# EasyEDA schematic Schematic.json
TITLE: Test Schematic - Stepper Driver + Tiny2040; REV: 2.0; Date: 2022-11-02; Sheet: 1/1; Drawn By: Der gang; Company: Wesel x Duisburg GANG
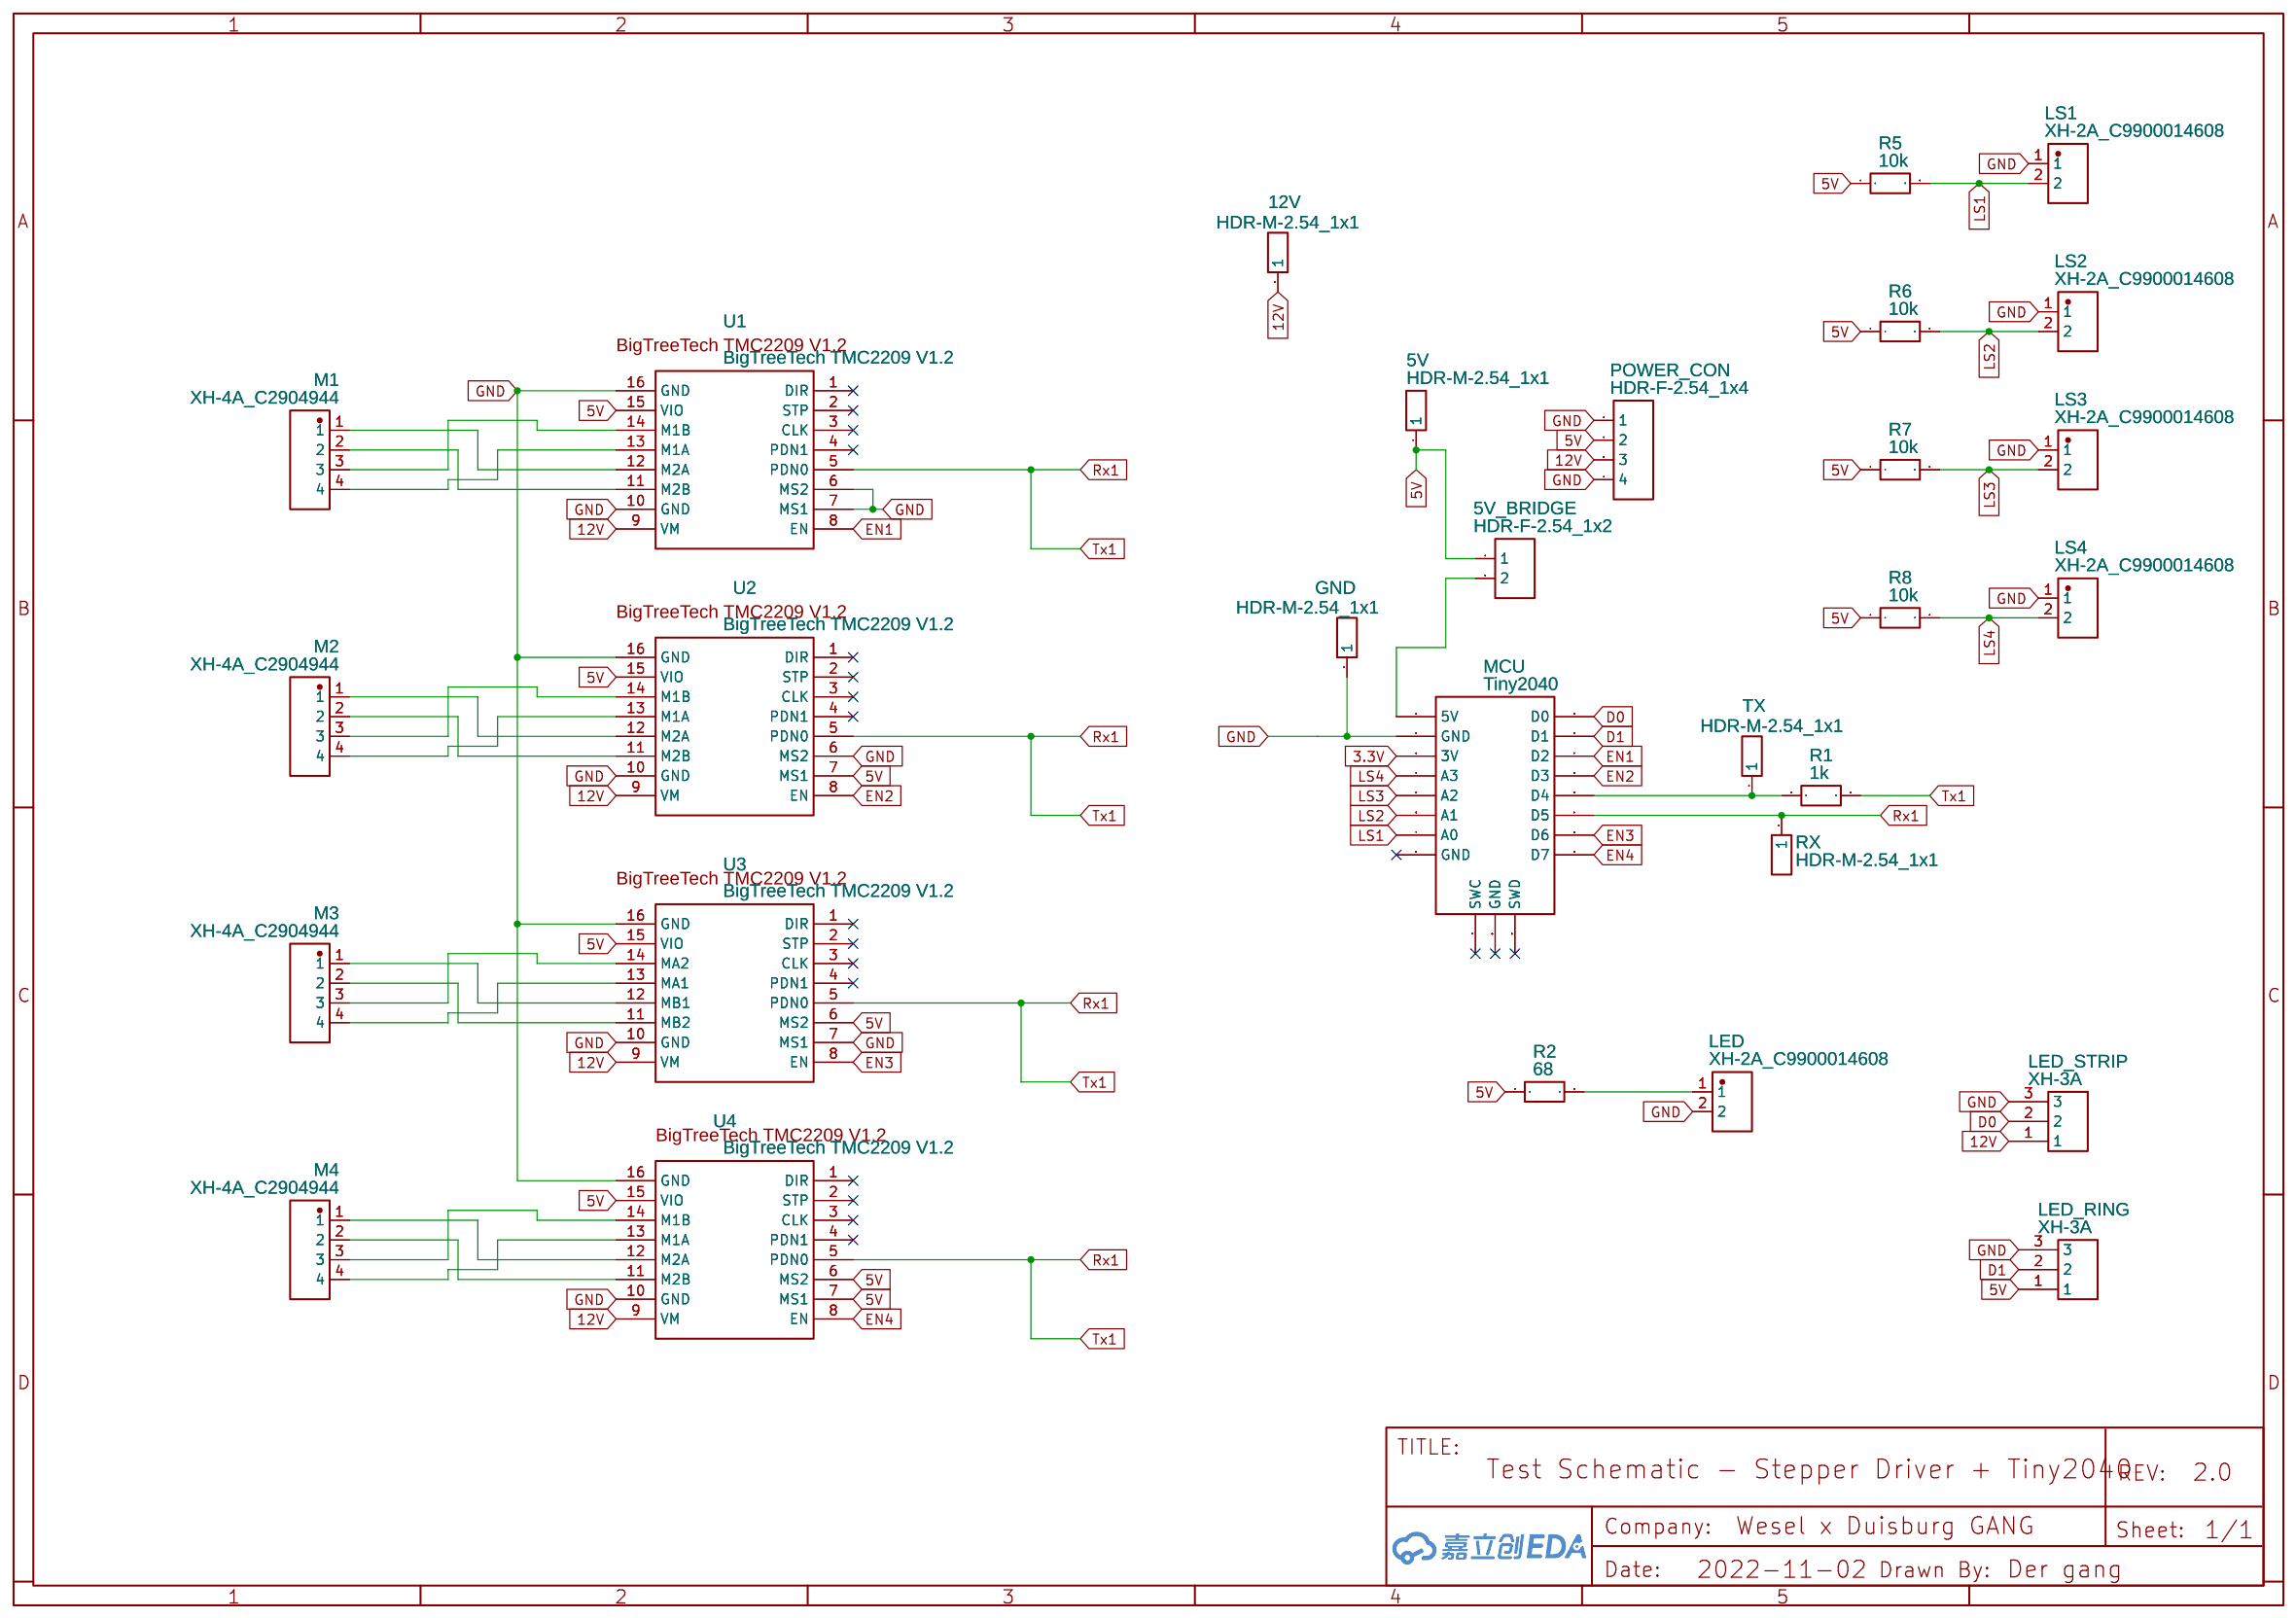
[diagram p0: schematic sheet]

## Parts
5V  HDR-M-2.54_1x1  [HDR-M-2.54_1X1]
5V_BRIDGE  HDR-F-2.54_1x2  [HDR-F-2.54_1X2]
12V  HDR-M-2.54_1x1  [HDR-M-2.54_1X1]
GND  HDR-M-2.54_1x1  [HDR-M-2.54_1X1]
LED  XH-2A_C9900014608  [CONN-TH_XH-2A]
LED_RING  XH-3A  [CONN-TH_XH-3A]
LED_STRIP  XH-3A  [CONN-TH_XH-3A]
LS1  XH-2A_C9900014608  [CONN-TH_XH-2A]
LS2  XH-2A_C9900014608  [CONN-TH_XH-2A]
LS3  XH-2A_C9900014608  [CONN-TH_XH-2A]
LS4  XH-2A_C9900014608  [CONN-TH_XH-2A]
M1  XH-4A_C2904944  [CONN-TH_4P-P2.50-XH2.54-4P]
M2  XH-4A_C2904944  [CONN-TH_4P-P2.50-XH2.54-4P]
M3  XH-4A_C2904944  [CONN-TH_4P-P2.50-XH2.54-4P]
M4  XH-4A_C2904944  [CONN-TH_4P-P2.50-XH2.54-4P]
MCU  Tiny2040  [TINY2040]
POWER_CON  HDR-F-2.54_1x4  [HDR-F-2.54_1X4]
R1  1k  [R0603]
R2  68  [R_AXIAL-0.3]
R5  10k  [R0603]
R6  10k  [R0603]
R7  10k  [R0603]
R8  10k  [R0603]
RX  HDR-M-2.54_1x1  [HDR-M-2.54_1X1]
TX  HDR-M-2.54_1x1  [HDR-M-2.54_1X1]
U1  BigTreeTech TMC2209 V1.2  [BIGTREETECH TMC2209 V1.2]
U2  BigTreeTech TMC2209 V1.2  [BIGTREETECH TMC2209 V1.2]
U3  BigTreeTech TMC2209 V1.2  [BIGTREETECH TMC2209 V1.2]
U4  BigTreeTech TMC2209 V1.2  [BIGTREETECH TMC2209 V1.2]

## Library data of the parts
5V 12V GND RX TX = HDR-M-2.54_1x1: Supplier Part: C81276; Supplier: LCSC; Contributor: LCEDA_Lib
5V_BRIDGE = HDR-F-2.54_1x2: Supplier Part: C49661; Supplier: LCSC; Contributor: LCEDA_Lib
LED LS1-LS4 = XH-2A_C9900014608: Supplier: LCSC; Supplier Part: C9900014608; Manufacturer: null; Manufacturer Part: XH-2A; JLCPCB Part Class: Extended Part; Contributor: lcsc
LED_RING LED_STRIP = XH-3A: Supplier: LCSC; Manufacturer: BOOMELE(博穆精密); Supplier Part: C2316; JLCPCB Part Class: Extended Part
M1-M4 = XH-4A_C2904944: Supplier: LCSC; Supplier Part: C2904944; Manufacturer: DEALON(德艺隆); Manufacturer Part: XH-4A; JLCPCB Part Class: Extended Part; Contributor: LCSC
MCU = Tiny2040: Manufacturer: Pimoroni; link: https://shop.pimoroni.com/products/tiny-2040; Contributor: Alexandre Hernandez Froio
POWER_CON = HDR-F-2.54_1x4: Supplier Part: C225501; Supplier: LCSC; Contributor: LCEDA_Lib
R1 R5-R8 = R_0603_EU: Contributor: LCEDA_Lib
R2 = R_AXIAL-0.3_EU: Contributor: LCEDA_Lib
U1-U4 = BigTreeTech TMC2209 V1.2: Manufacturer: BigTreeTech; Supplier: BigTreeTech; link: https://www.bigtree-tech.com/products/bigtreetech-tmc2209-v1-2-uart-stepper-motor-driver.html; Contributor: nikolay.malygin

## Nets
3.3V: MCU.3(3V)
5V: 5V.1 5V_BRIDGE.1 LED_RING.1 POWER_CON.2 R2.1 R5.1 R6.1 R7.1 R8.1 U1.15(VIO) U2.7(MS1) U2.15(VIO) U3.6(MS2) U3.15(VIO) U4.6(MS2) U4.7(MS1) U4.15(VIO)
12V: 12V.1 LED_STRIP.1 POWER_CON.3 U1.9(VM) U2.9(VM) U3.9(VM) U4.9(VM)
GND: GND.1 LED.2 LED_RING.3 LED_STRIP.3 LS1.1 LS2.1 LS3.1 LS4.1 MCU.2(GND) POWER_CON.1 POWER_CON.4 U1.6(MS2) U1.7(MS1) U1.10(GND) U1.16(GND) U2.6(MS2) U2.10(GND) U2.16(GND) U3.7(MS1) U3.10(GND) U3.16(GND) U4.10(GND) U4.16(GND)
D0: LED_STRIP.2 MCU.19(D0)
D1: LED_RING.2 MCU.18(D1)
EN1: MCU.17(D2) U1.8(EN)
EN2: MCU.16(D3) U2.8(EN)
EN3: MCU.13(D6) U3.8(EN)
EN4: MCU.12(D7) U4.8(EN)
LS1: LS1.2 MCU.7(A0) R5.2
LS2: LS2.2 MCU.6(A1) R6.2
LS3: LS3.2 MCU.5(A2) R7.2
LS4: LS4.2 MCU.4(A3) R8.2
Rx1: MCU.14(D5) R1.1 RX.1 U1.5(PDN0) U2.5(PDN0) U3.5(PDN0) U4.5(PDN0)
Net-(5V_BRIDGE-2): 5V_BRIDGE.2 MCU.1(5V)
Net-(LED-1): LED.1 R2.2
Net-(M1-1): M1.1 U1.12(M2A)
Net-(M1-2): M1.2 U1.11(M2B)
Net-(M1-3): M1.3 U1.14(M1B)
Net-(M1-4): M1.4 U1.13(M1A)
Net-(M2-1): M2.1 U2.12(M2A)
Net-(M2-2): M2.2 U2.11(M2B)
Net-(M2-3): M2.3 U2.14(M1B)
Net-(M2-4): M2.4 U2.13(M1A)
Net-(M3-1): M3.1 U3.12(MB1)
Net-(M3-2): M3.2 U3.11(MB2)
Net-(M3-3): M3.3 U3.14(MA2)
Net-(M3-4): M3.4 U3.13(MA1)
Net-(M4-1): M4.1 U4.12(M2A)
Net-(M4-2): M4.2 U4.11(M2B)
Net-(M4-3): M4.3 U4.14(M1B)
Net-(M4-4): M4.4 U4.13(M1A)
Net-(MCU-15): MCU.15(D4) R1.2 TX.1

Not connected (* = marked no-connect by the designer): MCU 8(GND)* 9(SWC)* 10(GND)* 11(SWD)*; U1 1(DIR)* 2(STP)* 3(CLK)* 4(PDN1)*; U2 1(DIR)* 2(STP)* 3(CLK)* 4(PDN1)*; U3 1(DIR)* 2(STP)* 3(CLK)* 4(PDN1)*; U4 1(DIR)* 2(STP)* 3(CLK)* 4(PDN1)*
